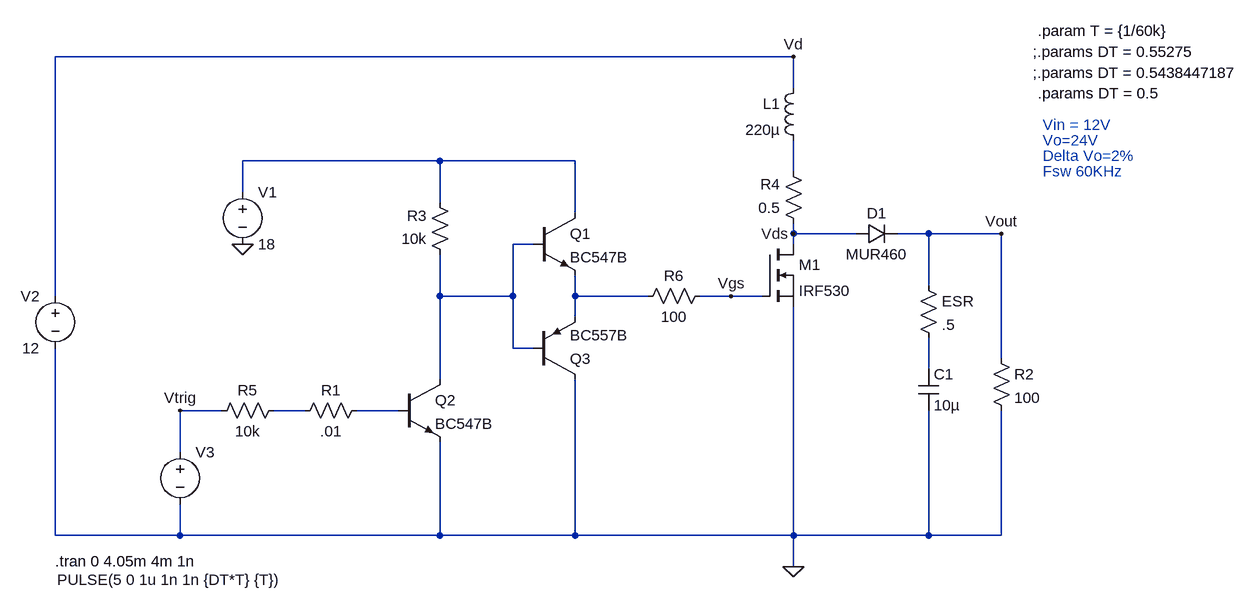
[diagram p0: schematic TP1.asc]
TP1.asc, the LTspice schematic file:
Version 4
SHEET 1 1356 680
WIRE 592 -272 -544 -272
WIRE 592 -224 592 -272
WIRE 48 -112 -256 -112
WIRE 256 -112 48 -112
WIRE 592 -96 592 -144
WIRE -256 -64 -256 -112
WIRE 48 -48 48 -112
WIRE 256 -32 256 -112
WIRE 592 0 592 -16
WIRE 688 0 592 0
WIRE 800 0 752 0
WIRE 912 0 800 0
WIRE 192 16 160 16
WIRE 592 16 592 0
WIRE 800 80 800 0
WIRE -544 96 -544 -272
WIRE 48 96 48 32
WIRE 160 96 160 16
WIRE 160 96 48 96
WIRE 256 96 256 64
WIRE 368 96 256 96
WIRE 496 96 448 96
WIRE 544 96 496 96
WIRE 256 128 256 96
WIRE 160 176 160 96
WIRE 192 176 160 176
WIRE 912 192 912 0
WIRE 800 208 800 160
WIRE 48 224 48 96
WIRE -288 272 -352 272
WIRE -160 272 -208 272
WIRE -16 272 -80 272
WIRE -352 336 -352 272
WIRE -544 464 -544 176
WIRE -352 464 -352 416
WIRE -352 464 -544 464
WIRE 48 464 48 320
WIRE 48 464 -352 464
WIRE 256 464 256 224
WIRE 256 464 48 464
WIRE 592 464 592 112
WIRE 592 464 256 464
WIRE 800 464 800 272
WIRE 800 464 592 464
WIRE 912 464 912 272
WIRE 912 464 800 464
WIRE 592 512 592 464
FLAG 592 512 0
FLAG 496 96 Vgs
FLAG 912 0 Vout
FLAG -352 272 Vtrig
FLAG 592 0 Vds
FLAG -256 16 0
FLAG 592 -272 Vd
SYMBOL npn 192 -32 R0
SYMATTR InstName Q1
SYMATTR Value BC547B
SYMBOL npn -16 224 R0
SYMATTR InstName Q2
SYMATTR Value BC547B
SYMBOL pnp 192 224 M180
SYMATTR InstName Q3
SYMATTR Value BC557B
SYMBOL nmos 544 16 R0
SYMATTR InstName M1
SYMATTR Value IRF530
SYMBOL diode 688 16 R270
WINDOW 0 32 32 VTop 2
WINDOW 3 0 32 VBottom 2
SYMATTR InstName D1
SYMATTR Value MUR460
SYMBOL res 464 80 R90
WINDOW 0 0 56 VBottom 2
WINDOW 3 32 56 VTop 2
SYMATTR InstName R6
SYMATTR Value 100
SYMBOL res -64 256 R90
WINDOW 0 0 56 VBottom 2
WINDOW 3 32 56 VTop 2
SYMATTR InstName R1
SYMATTR Value .01
SYMBOL res 608 0 R180
WINDOW 0 36 76 Left 2
WINDOW 3 36 40 Left 2
SYMATTR InstName R4
SYMATTR Value 0.5
SYMBOL res 64 48 R180
WINDOW 0 36 76 Left 2
WINDOW 3 36 40 Left 2
SYMATTR InstName R3
SYMATTR Value 10k
SYMBOL res -304 288 R270
WINDOW 0 32 56 VTop 2
WINDOW 3 0 56 VBottom 2
SYMATTR InstName R5
SYMATTR Value 10k
SYMBOL ind 608 -240 M0
SYMATTR InstName L1
SYMATTR Value 220µ
SYMBOL voltage -544 80 M0
WINDOW 123 0 0 Left 0
WINDOW 39 0 0 Left 0
SYMATTR InstName V2
SYMATTR Value 12
SYMBOL cap 784 208 R0
SYMATTR InstName C1
SYMATTR Value 10µ
SYMBOL res 896 176 R0
SYMATTR InstName R2
SYMATTR Value 100
SYMBOL voltage -352 320 R0
WINDOW 3 -189 212 Left 2
WINDOW 123 0 0 Left 0
WINDOW 39 0 0 Left 0
SYMATTR Value PULSE(5 0 1u 1n 1n {DT*T} {T})
SYMATTR InstName V3
SYMBOL voltage -256 -80 R0
WINDOW 123 0 0 Left 0
WINDOW 39 0 0 Left 0
SYMATTR InstName V1
SYMATTR Value 18
SYMBOL res 784 64 R0
SYMATTR InstName ESR
SYMATTR Value .5
TEXT -544 504 Left 2 !.tran 0 4.05m 4m 1n
TEXT 976 -168 Left 2 ;Vin = 12V
TEXT 976 -144 Left 2 ;Vo=24V
TEXT 976 -120 Left 2 ;Delta Vo=2%
TEXT 976 -96 Left 2 ;Fsw 60KHz
TEXT 960 -280 Left 2 !;.params DT = 0.55275
TEXT 968 -312 Left 2 !.param T = {1/60k}
TEXT 960 -248 Left 2 !;.params DT = 0.5438447187
TEXT 968 -216 Left 2 !.params DT = 0.5

The netlist it stands for:
* TP1.asc
Q1 N001 N003 N004 0 BC547B
Q2 N003 N007 0 0 BC547B
Q3 0 N003 N004 0 BC557B
M1 Vds Vgs 0 0 IRF530
D1 Vds Vout MUR460
R6 Vgs N004 100
R1 N007 N006 .01
R4 Vds N002 0.5
R3 N003 N001 10k
R5 Vtrig N006 10k
L1 Vd N002 220µ
V2 Vd 0 12
C1 N005 0 10µ
R2 Vout 0 100
V3 Vtrig 0 PULSE(5 0 1u 1n 1n {DT*T} {T})
V1 N001 0 18
R§ESR Vout N005 .5
.model D D
.lib standard.dio
.model NPN NPN
.model PNP PNP
.lib standard.bjt
.model NMOS NMOS
.model PMOS PMOS
.lib standard.mos
.tran 0 4.05m 4m 1n
* Vin = 12V
* Vo=24V
* Delta Vo=2%
* Fsw 60KHz
;.params DT = 0.55275
.param T = {1/60k}
;.params DT = 0.5438447187
.params DT = 0.5
.backanno
.end